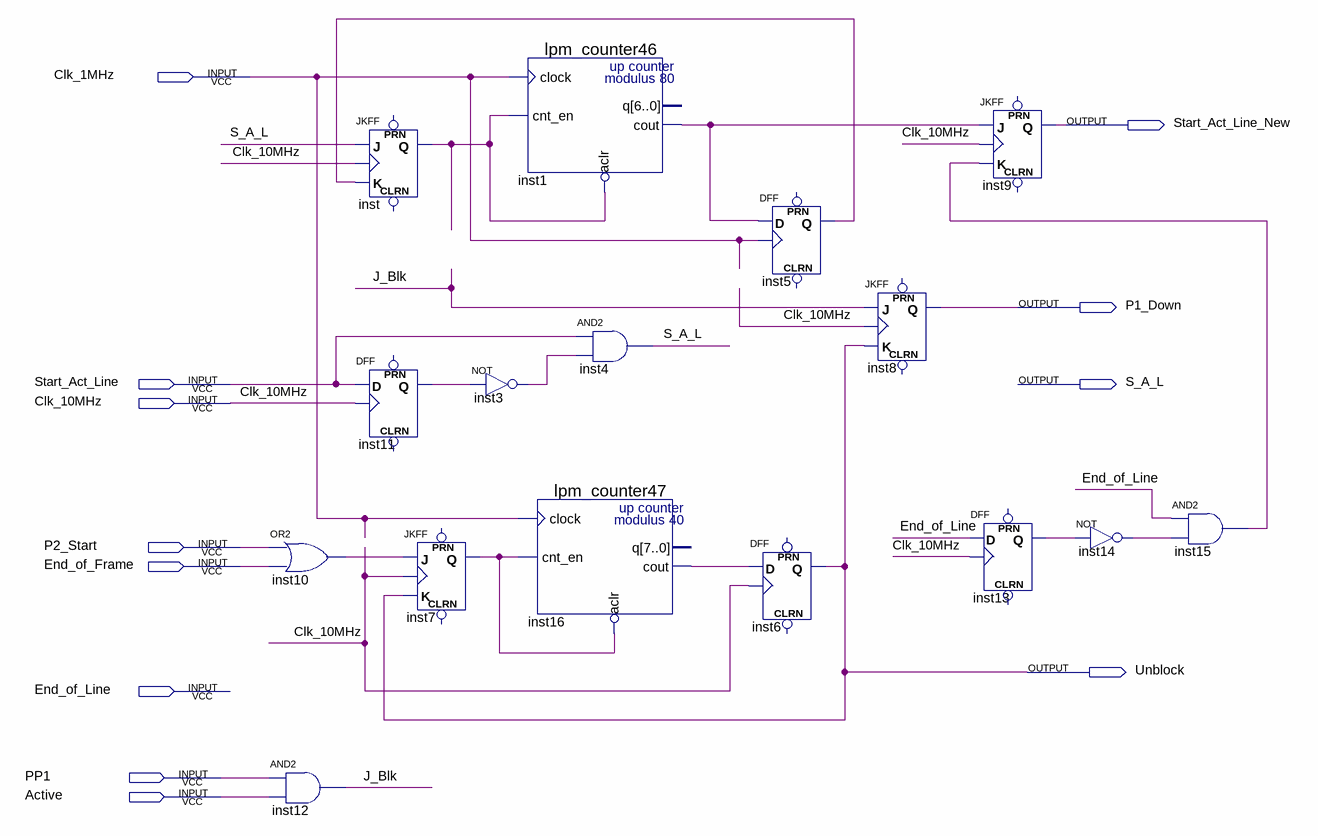
[diagram p0: schematic sheet]
// Quartus schematic P1_corrector_module.bdf as structural Verilog: 16 symbols, 12 pins
module P1_corrector_module (
  input  Clk_1MHz,
  input  Start_Act_Line,
  input  Clk_10MHz,
  input  P2_Start,
  input  End_of_Frame,
  input  End_of_Line,
  input  PP1,
  input  Active,
  output Start_Act_Line_New,
  output P1_Down,
  output S_A_L,
  output Unblock
);

  wire inst1_cout, inst3_out, inst5_q, inst7_q, inst10_out, inst11_q, inst13_q, inst14_out, inst15_out,
       inst16_cout, inst_q, J_Blk;

  or inst10 (inst10_out, P2_Start, End_of_Frame);
  and inst12 (J_Blk, PP1, Active);
  JKFF inst (.K(inst5_q), .J(S_A_L), .CLK(Clk_10MHz), .Q(inst_q));  // open: PRN, CLRN
  DFF inst11 (.CLK(Clk_10MHz), .D(Start_Act_Line), .Q(inst11_q));  // open: CLRN, PRN
  not inst3 (inst3_out, inst11_q);
  JKFF inst7 (.K(Unblock), .J(inst10_out), .CLK(Clk_10MHz), .Q(inst7_q));  // open: PRN, CLRN
  lpm_counter46 inst1 (.clock(Clk_1MHz), .cnt_en(inst_q), .aclr(~inst_q), .cout(inst1_cout));  // open: q
  lpm_counter47 inst16 (.clock(Clk_1MHz), .cnt_en(inst7_q), .aclr(~inst7_q), .cout(inst16_cout));  // open: q
  and inst4 (S_A_L, Start_Act_Line, inst3_out);
  DFF inst5 (.CLK(Clk_1MHz), .D(inst1_cout), .Q(inst5_q));  // open: CLRN, PRN
  DFF inst6 (.CLK(Clk_10MHz), .D(inst16_cout), .Q(Unblock));  // open: CLRN, PRN
  JKFF inst8 (.K(Unblock), .J(J_Blk), .CLK(Clk_10MHz), .Q(P1_Down));  // open: PRN, CLRN
  JKFF inst9 (.K(inst15_out), .J(inst1_cout), .CLK(Clk_10MHz), .Q(Start_Act_Line_New));  // open: PRN, CLRN
  DFF inst13 (.CLK(Clk_10MHz), .D(End_of_Line), .Q(inst13_q));  // open: CLRN, PRN
  not inst14 (inst14_out, inst13_q);
  and inst15 (inst15_out, End_of_Line, inst14_out);
endmodule
